# EAGLE design interro-io-board-r2 (EAGLE 5.11)
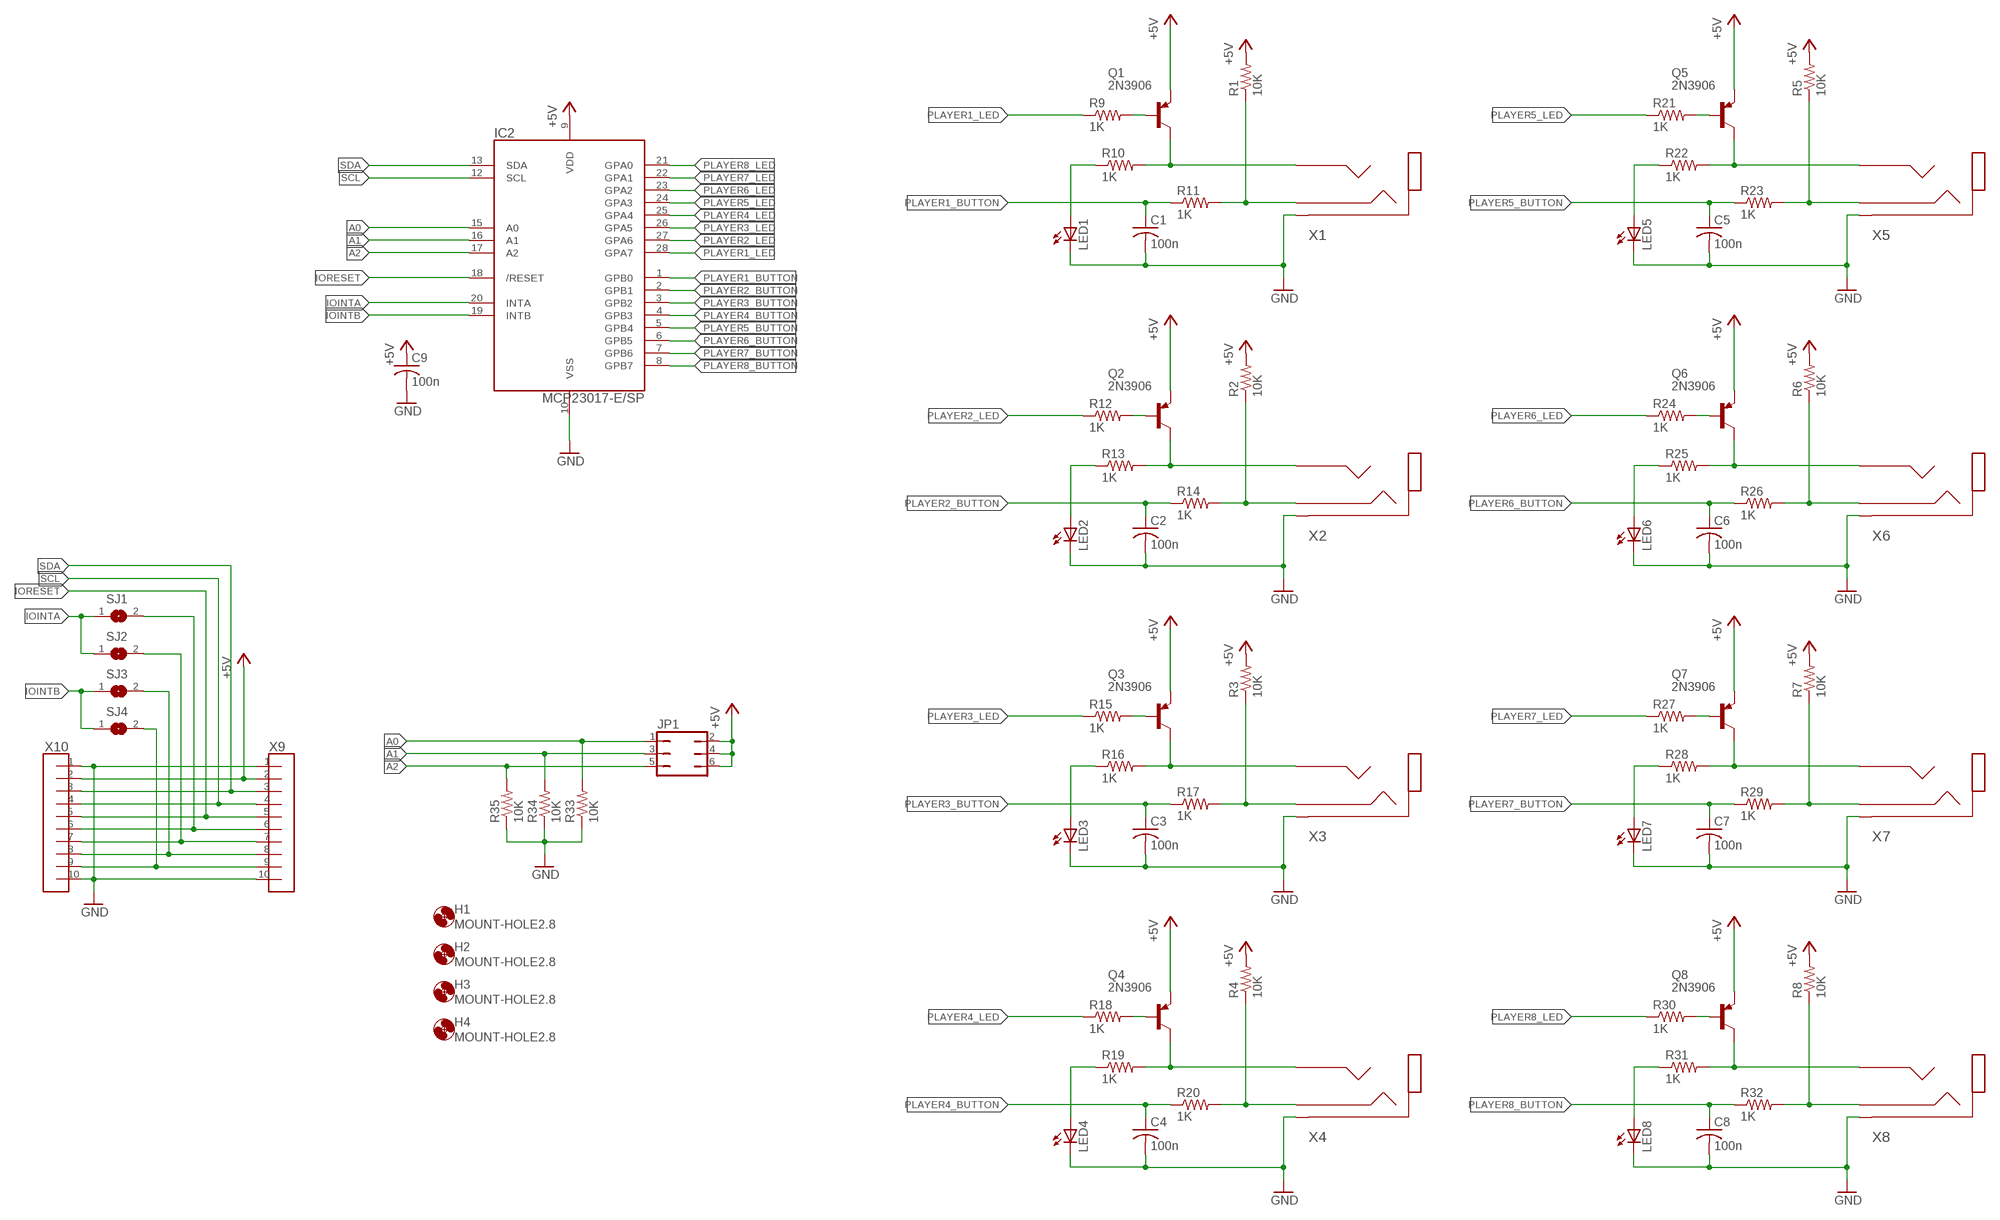
[diagram p0: schematic, sheet 1]

## Parts
C1  100n  C-US050-025X075  [C050-025X075]
C2  100n  C-US050-025X075  [C050-025X075]
C3  100n  C-US050-025X075  [C050-025X075]
C4  100n  C-US050-025X075  [C050-025X075]
C5  100n  C-US050-025X075  [C050-025X075]
C6  100n  C-US050-025X075  [C050-025X075]
C7  100n  C-US050-025X075  [C050-025X075]
C8  100n  C-US050-025X075  [C050-025X075]
C9  100n  C-US050-025X075  [C050-025X075]
H1  MOUNT-HOLE2.8  [2,8]
H2  MOUNT-HOLE2.8  [2,8]
H3  MOUNT-HOLE2.8  [2,8]
H4  MOUNT-HOLE2.8  [2,8]
IC2  MCP23017-E/SP  [DIP-28S]
JP1  JP3Q  [JP3Q]
LED1  LED3MM  [LED3MM]
LED2  LED3MM  [LED3MM]
LED3  LED3MM  [LED3MM]
LED4  LED3MM  [LED3MM]
LED5  LED3MM  [LED3MM]
LED6  LED3MM  [LED3MM]
LED7  LED3MM  [LED3MM]
LED8  LED3MM  [LED3MM]
Q1  2N3906  [TO92]
Q2  2N3906  [TO92]
Q3  2N3906  [TO92]
Q4  2N3906  [TO92]
Q5  2N3906  [TO92]
Q6  2N3906  [TO92]
Q7  2N3906  [TO92]
Q8  2N3906  [TO92]
R1  10K  R-US_0207/7  [0207/7]
R2  10K  R-US_0207/7  [0207/7]
R3  10K  R-US_0207/7  [0207/7]
R4  10K  R-US_0207/7  [0207/7]
R5  10K  R-US_0207/7  [0207/7]
R6  10K  R-US_0207/7  [0207/7]
R7  10K  R-US_0207/7  [0207/7]
R8  10K  R-US_0207/7  [0207/7]
R9  1K  R-US_0207/7  [0207/7]
R10  1K  R-US_0207/7  [0207/7]
R11  1K  R-US_0207/7  [0207/7]
R12  1K  R-US_0207/7  [0207/7]
R13  1K  R-US_0207/7  [0207/7]
R14  1K  R-US_0207/7  [0207/7]
R15  1K  R-US_0207/7  [0207/7]
R16  1K  R-US_0207/7  [0207/7]
R17  1K  R-US_0207/7  [0207/7]
R18  1K  R-US_0207/7  [0207/7]
R19  1K  R-US_0207/7  [0207/7]
R20  1K  R-US_0207/7  [0207/7]
R21  1K  R-US_0207/7  [0207/7]
R22  1K  R-US_0207/7  [0207/7]
R23  1K  R-US_0207/7  [0207/7]
R24  1K  R-US_0207/7  [0207/7]
R25  1K  R-US_0207/7  [0207/7]
R26  1K  R-US_0207/7  [0207/7]
R27  1K  R-US_0207/7  [0207/7]
R28  1K  R-US_0207/7  [0207/7]
R29  1K  R-US_0207/7  [0207/7]
R30  1K  R-US_0207/7  [0207/7]
R31  1K  R-US_0207/7  [0207/7]
R32  1K  R-US_0207/7  [0207/7]
R33  10K  R-US_0207/7  [0207/7]
R34  10K  R-US_0207/7  [0207/7]
R35  10K  R-US_0207/7  [0207/7]
SJ1  SJ  [SJ]
SJ2  SJ  [SJ]
SJ3  SJ  [SJ]
SJ4  SJ  [SJ]
X1  SJ1-3533N  [SJ1-3533N]
X2  SJ1-3533N  [SJ1-3533N]
X3  SJ1-3533N  [SJ1-3533N]
X4  SJ1-3533N  [SJ1-3533N]
X5  SJ1-3533N  [SJ1-3533N]
X6  SJ1-3533N  [SJ1-3533N]
X7  SJ1-3533N  [SJ1-3533N]
X8  SJ1-3533N  [SJ1-3533N]
X9  M10-100MIL  [100MIL-10]
X10  M10-100MIL  [100MIL-10]

## Nets
+5V: C9.1 IC2.9(VDD) JP1.2 JP1.4 JP1.6 Q1.3(E) Q2.3(E) Q3.3(E) Q4.3(E) Q5.3(E) Q6.3(E) Q7.3(E) Q8.3(E) R1.2 R2.2 R3.2 R4.2 R5.2 R6.2 R7.2 R8.2 X9.2 X10.2
A0: IC2.15(A0) JP1.1 R33.2
A1: IC2.16(A1) JP1.3 R34.2
A2: IC2.17(A2) JP1.5 R35.2
GND: C1.2 C2.2 C3.2 C4.2 C5.2 C6.2 C7.2 C8.2 C9.2 IC2.10(VSS) LED1.K(C) LED2.K(C) LED3.K(C) LED4.K(C) LED5.K(C) LED6.K(C) LED7.K(C) LED8.K(C) R33.1 R34.1 R35.1 X1.SHIELD(SLEEVE) X2.SHIELD(SLEEVE) X3.SHIELD(SLEEVE) X4.SHIELD(SLEEVE) X5.SHIELD(SLEEVE) X6.SHIELD(SLEEVE) X7.SHIELD(SLEEVE) X8.SHIELD(SLEEVE) X9.1 X9.10 X10.1 X10.10
IOINTA: IC2.20(INTA) SJ1.1 SJ2.1
IOINTB: IC2.19(INTB) SJ3.1 SJ4.1
IORESET: IC2.18(/RESET) X9.5 X10.5
N$1: SJ2.2 X9.7 X10.7
N$2: SJ3.2 X9.8 X10.8
N$3: SJ4.2 X9.9 X10.9
N$5: SJ1.2 X9.6 X10.6
N$9: R1.1 R11.2 X1.RING
N$10: Q1.1(C) R10.2 X1.TIP
N$12: Q1.2(B) R9.2
N$13: LED1.A R10.1
N$14: R2.1 R14.2 X2.RING
N$15: Q2.1(C) R13.2 X2.TIP
N$16: Q2.2(B) R12.2
N$17: LED2.A R13.1
N$18: R3.1 R17.2 X3.RING
N$19: Q3.1(C) R16.2 X3.TIP
N$20: Q3.2(B) R15.2
N$21: LED3.A R16.1
N$22: R4.1 R20.2 X4.RING
N$23: Q4.1(C) R19.2 X4.TIP
N$24: Q4.2(B) R18.2
N$25: LED4.A R19.1
N$26: R5.1 R23.2 X5.RING
N$27: Q5.1(C) R22.2 X5.TIP
N$28: Q5.2(B) R21.2
N$29: LED5.A R22.1
N$30: R6.1 R26.2 X6.RING
N$31: Q6.1(C) R25.2 X6.TIP
N$32: Q6.2(B) R24.2
N$33: LED6.A R25.1
N$34: R7.1 R29.2 X7.RING
N$35: Q7.1(C) R28.2 X7.TIP
N$36: Q7.2(B) R27.2
N$37: LED7.A R28.1
N$38: R8.1 R32.2 X8.RING
N$39: Q8.1(C) R31.2 X8.TIP
N$40: Q8.2(B) R30.2
N$41: LED8.A R31.1
PLAYER1_BUTTON: C1.1 IC2.1(GPB0) R11.1
PLAYER1_LED: IC2.28(GPA7) R9.1
PLAYER2_BUTTON: C2.1 IC2.2(GPB1) R14.1
PLAYER2_LED: IC2.27(GPA6) R12.1
PLAYER3_BUTTON: C3.1 IC2.3(GPB2) R17.1
PLAYER3_LED: IC2.26(GPA5) R15.1
PLAYER4_BUTTON: C4.1 IC2.4(GPB3) R20.1
PLAYER4_LED: IC2.25(GPA4) R18.1
PLAYER5_BUTTON: C5.1 IC2.5(GPB4) R23.1
PLAYER5_LED: IC2.24(GPA3) R21.1
PLAYER6_BUTTON: C6.1 IC2.6(GPB5) R26.1
PLAYER6_LED: IC2.23(GPA2) R24.1
PLAYER7_BUTTON: C7.1 IC2.7(GPB6) R29.1
PLAYER7_LED: IC2.22(GPA1) R27.1
PLAYER8_BUTTON: C8.1 IC2.8(GPB7) R32.1
PLAYER8_LED: IC2.21(GPA0) R30.1
SCL: IC2.12(SCL) X9.4 X10.4
SDA: IC2.13(SDA) X9.3 X10.3

## Library data of the parts
C1-C9 = rcl:C-US: CAPACITOR, American symbol
H1-H4 = holes:MOUNT-HOLE: MOUNTING HOLE with drill center marker
IC2 = rbg-microchip-ioexpander:MCP23017
JP1 = jumper:JP3Q: JUMPER
LED1-LED8 = led:LED: LED OSRAM: - CHIPLED LG R971, LG N971, LY N971, LG Q971, LY Q971, LO R971, LY R971 LH N974, LH R974 LS Q976, LO Q976, LY Q976 LO Q996 - Hyper CHIPLED LW Q18S LB Q993, LB Q99A, LB R99A - SideLED LS A670, LO A670, LY A670, LG A670, LP A670 LB A673, LV A673, LT A673, LW A673 LH A674 LY A675 LS A676, LA A676, LO A676, LY A676, LW A676 LS A679, LY A679, LG A679 - Hyper Micro SIDELED® LS Y876, LA Y876, LO Y876, LY Y876 LT Y87S - SmartLED LW L88C, LW L88S LB L89C, LB L89S, LG L890 LS L89K, LO L89K, LY L89K LS L896, LA L896, LO L896, LY L896 - TOPLED LS T670, LO T670, LY T670, LG T670, LP T670 LSG T670, LSP T670, LSY T670, LOP T670, LYG T670 LG T671, LOG T671, LSG T671 LB T673, LV T673, LT T673, LW T673 LH T674 LS T676, LA T676, LO T676, LY T676, LB T676, LH T676, LSB T676, LW T676 LB T67C, LV T67C, LT T67C, LS T67K, LO T67K, LY T67K, LW E67C LS E67B, LA E67B, LO E67B, LY E67B, LB E67C, LV E67C, LT E67C LW T67C LS T679, LY T679, LG T679 LS T770, LO T770, LY T770, LG T770, LP T770 LB T773, LV T773, LT T773, LW T773 LH T774 LS E675, LA E675, LY E675, LS T675 LS T776, LA T776, LO T776, LY T776, LB T776 LHGB T686 LT T68C, LB T68C - Hyper Mini TOPLED® LB M676 - Mini TOPLED Santana® LG M470 LS M47K, LO M47K, LY M47K Source: http://www.osram.convergy.de LUXEON: - LUMILED® LXK2-PW12-R00, LXK2-PW12-S00, LXK2-PW14-U00, LXK2-PW14-V00 LXK2-PM12-R00, LXK2-PM12-S00, LXK2-PM14-U00 LXK2-PE12-Q00, LXK2-PE12-R00, LXK2-PE12-S00, LXK2-PE14-T00, LXK2-PE14-U00 LXK2-PB12-K00, LXK2-PB12-L00, LXK2-PB12-M00, LXK2-PB14-N00, LXK2-PB14-P00, LXK2-PB14-Q00 LXK2-PR12-L00, LXK2-PR12-M00, LXK2-PR14-Q00, LXK2-PR14-R00 LXK2-PD12-Q00, LXK2-PD12-R00, LXK2-PD12-S00 LXK2-PH12-R00, LXK2-PH12-S00 LXK2-PL12-P00, LXK2-PL12-Q00, LXK2-PL12-R00 Source: www.luxeon.com KINGBRIGHT: KA-3528ASYC Source: www.kingbright.com
Q1-Q8 = transistor-pnp:2N3906: PNP Transistor
R1-R35 = rcl:R-US_: RESISTOR, American symbol
SJ1-SJ4 = jumper:SJ: SMD solder JUMPER
X1-X8 = rbg-cui-audio:SJ1-3533N
X9 X10 = rbg-generic-headers:M10-100MIL

## Board
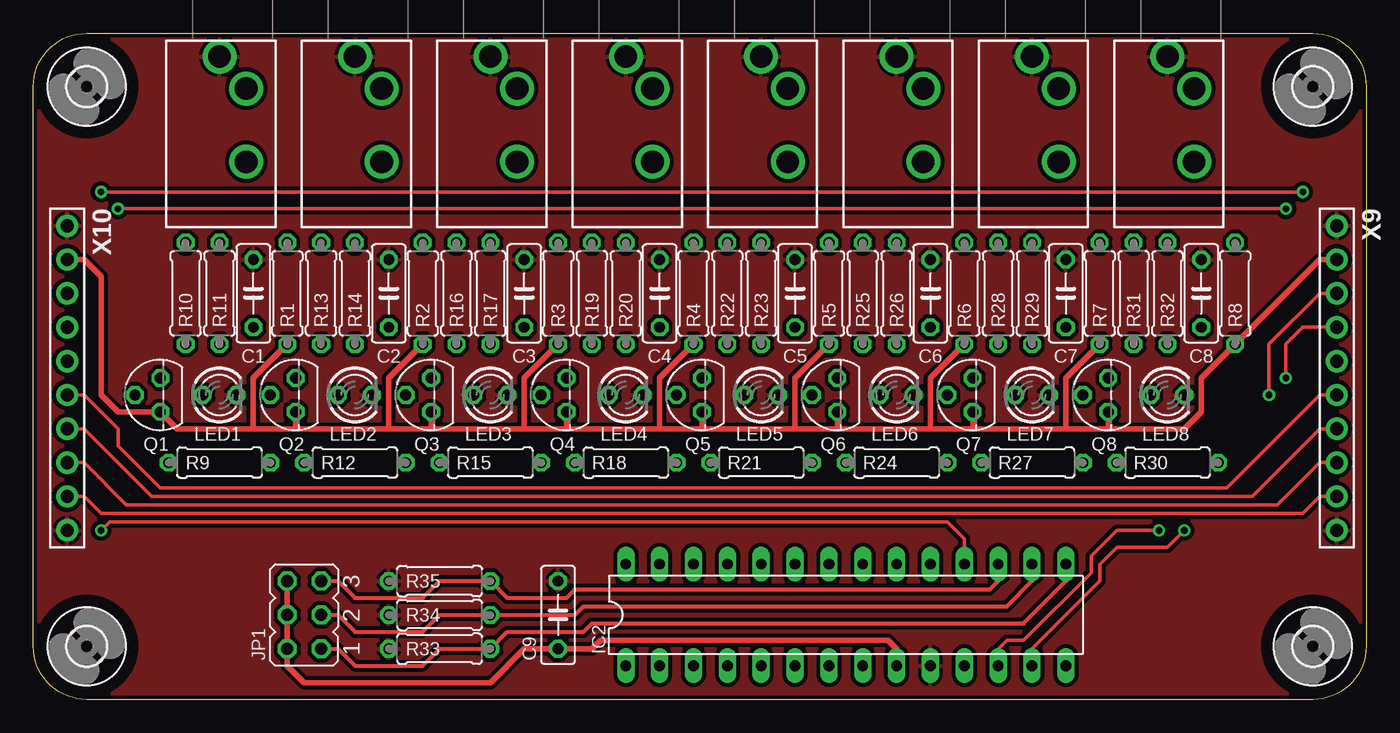
[diagram p1: board, top side]
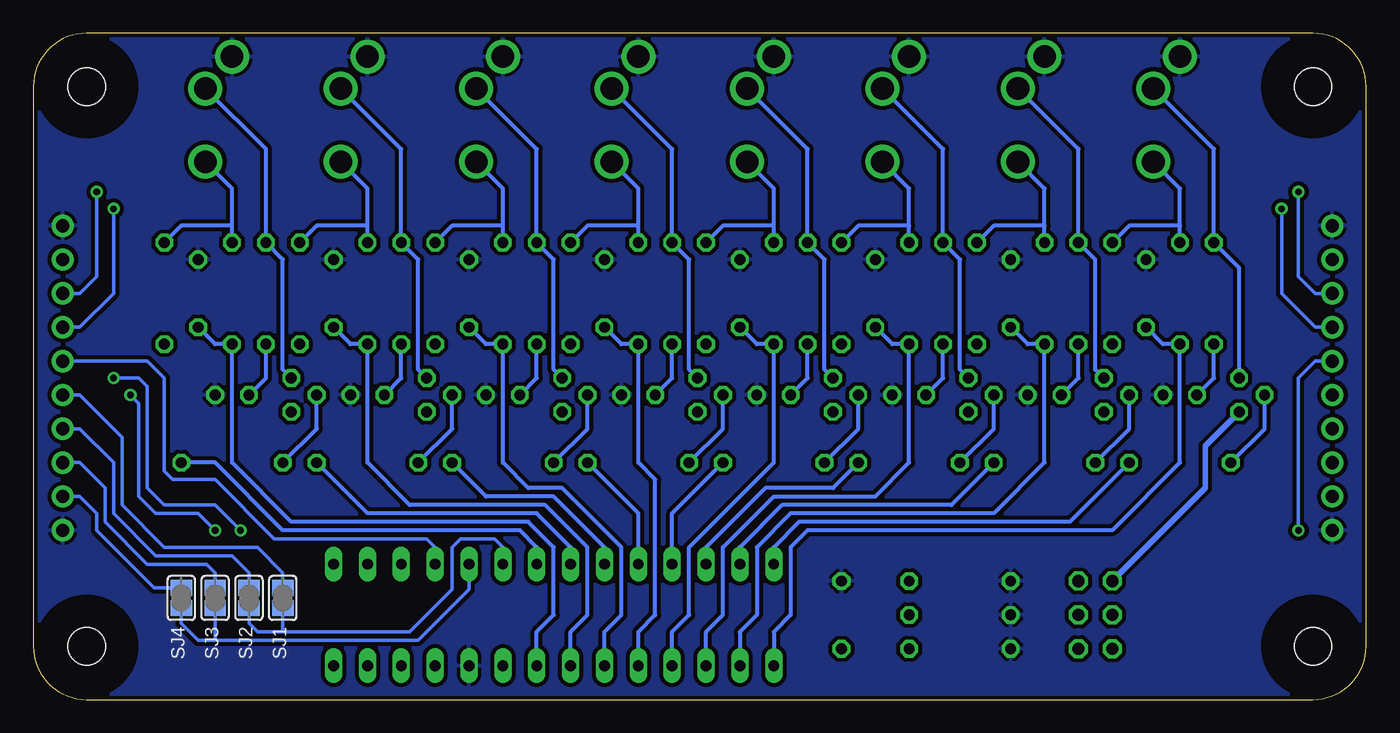
[diagram p2: board, bottom side, seen from below]

Size 100 x 50 mm. Coordinates in mm from the lower left corner, seen from the top.
Outline: 0,46 arc-90 4,50 96,50 arc-90 100,46 100,4 arc-90 96,0 4,0 arc-90 0,4 0,46
Copper layers (1*16): Top 0.035mm / dielectric 1.5mm / Bottom 0.035mm
Design rules "default *": minimum track width 10mil, minimum drill 19mil, track to track 10mil, track to pad 10mil, pad to pad 10mil, via to via 10mil, smd to smd 10mil, copper to edge 10mil, drill to drill 8mil, minimum pad ring 10mil, minimum via ring 8mil, stop-mask expansion 4mil, vias tented up to drill 20mil, thermal gap 10mil

### Footprints (pad centres in the part's own frame; a part is rotated, then mirrored left to right if it is on the bottom)
C050-025X075 = drill 0.813 octagon: 1 -2.54,0; 2 2.54,0
2,8 = hole 2.8: 0,0
DIP-28S = drill 0.813 long: 1 -16.51,-3.81; 2 -13.97,-3.81; 3 -11.43,-3.81; 4 -8.89,-3.81; 5 -6.35,-3.81; 6 -3.81,-3.81; 7 -1.27,-3.81; 8 1.27,-3.81; 9 3.81,-3.81; 10 6.35,-3.81; 11 8.89,-3.81; 12 11.43,-3.81; 13 13.97,-3.81; 14 16.51,-3.81; 15 16.51,3.81; 16 13.97,3.81; 17 11.43,3.81; 18 8.89,3.81; 19 6.35,3.81; 20 3.81,3.81; 21 1.27,3.81; 22 -1.27,3.81; 23 -3.81,3.81; 24 -6.35,3.81; 25 -8.89,3.81; 26 -11.43,3.81; 27 -13.97,3.81; 28 -16.51,3.81
JP3Q = drill 0.914 octagon: 1 -2.54,-1.27; 2 -2.54,1.27; 3 0,-1.27; 4 0,1.27; 5 2.54,-1.27; 6 2.54,1.27
LED3MM = drill 0.813 octagon: A -1.27,0; K 1.27,0
TO92 = drill 0.813 octagon: 1 1.27,0; 2 0,1.905; 3 -1.27,0
0207/7 = drill 0.813 octagon: 1 -3.81,0; 2 3.81,0
SJ = smd 1.168 x 1.6: 1 -0.762,0; 2 0.762,0
SJ1-3533N = drill 1.7 round: RING 7.9,2; SHIELD 0,0; TIP 2.4,2
100MIL-10 = drill 1 pad 1.676 round: 1 -11.43,0; 2 -8.89,0; 3 -6.35,0; 4 -3.81,0; 5 -1.27,0; 6 1.27,0; 7 3.81,0; 8 6.35,0; 9 8.89,0; 10 11.43,0

### Placement (x,y rotation side)
C1  16.51,30.48 90 top
C2  26.67,30.48 90 top
C3  36.83,30.48 90 top
C4  46.99,30.48 90 top
C5  57.15,30.48 90 top
C6  67.31,30.48 90 top
C7  77.47,30.48 90 top
C8  87.63,30.48 90 top
C9  39.37,6.35 90 top
H1  4,4 0 top
H2  4,46 0 top
H3  96,46 0 top
H4  96,4 0 top
IC2  60.96,6.35 0 top
JP1  20.32,6.35 90 top
LED1  13.97,22.86 0 top
LED2  24.13,22.86 0 top
LED3  34.29,22.86 0 top
LED4  44.45,22.86 0 top
LED5  54.61,22.86 0 top
LED6  64.77,22.86 0 top
LED7  74.93,22.86 0 top
LED8  85.09,22.86 0 top
Q1  9.53,22.86 90 top
Q2  19.68,22.86 90 top
Q3  29.84,22.86 90 top
Q4  40.01,22.86 90 top
Q5  50.16,22.86 90 top
Q6  60.33,22.86 90 top
Q7  70.48,22.86 90 top
Q8  80.64,22.86 90 top
R1  19.05,30.48 270 top
R2  29.21,30.48 270 top
R3  39.37,30.48 270 top
R4  49.53,30.48 270 top
R5  59.69,30.48 270 top
R6  69.85,30.48 270 top
R7  80.01,30.48 270 top
R8  90.17,30.48 270 top
R9  13.97,17.78 180 top
R10  11.43,30.48 90 top
R11  13.97,30.48 90 top
R12  24.13,17.78 180 top
R13  21.59,30.48 90 top
R14  24.13,30.48 90 top
R15  34.29,17.78 180 top
R16  31.75,30.48 90 top
R17  34.29,30.48 90 top
R18  44.45,17.78 180 top
R19  41.91,30.48 90 top
R20  44.45,30.48 90 top
R21  54.61,17.78 180 top
R22  52.07,30.48 90 top
R23  54.61,30.48 90 top
R24  64.77,17.78 180 top
R25  62.23,30.48 90 top
R26  64.77,30.48 90 top
R27  74.93,17.78 180 top
R28  72.39,30.48 90 top
R29  74.93,30.48 90 top
R30  85.09,17.78 180 top
R31  82.55,30.48 90 top
R32  85.09,30.48 90 top
R33  30.48,3.81 0 top
R34  30.48,6.35 0 top
R35  30.48,8.89 0 top
SJ1  81.28,7.62 90 bottom
SJ2  83.82,7.62 90 bottom
SJ3  86.36,7.62 90 bottom
SJ4  88.9,7.62 90 bottom
X1  13.97,48.26 270 top
X2  24.13,48.26 270 top
X3  34.29,48.26 270 top
X4  44.45,48.26 270 top
X5  54.61,48.26 270 top
X6  64.77,48.26 270 top
X7  74.93,48.26 270 top
X8  85.09,48.26 270 top
X9  97.79,24.13 270 top
X10  2.54,24.13 270 top

### Tracks (layer width: path | path; a pad name or v marks a point on that pad's centre or on a via)
+5V
  Top 0.406: 19.68,20.32 26.67,20.32 | 26.67,20.32 29.84,20.32 | 29.84,20.32 36.83,20.32 | 36.83,20.32 40.01,20.32 | 40.01,20.32 46.99,20.32 | 46.99,20.32 50.16,20.32 | 50.16,20.32 57.15,20.32 | 57.15,20.32 60.33,20.32 | 60.33,20.32 67.31,20.32 | 67.31,20.32 70.48,20.32 | 70.48,20.32 77.47,20.32 | 70.48,20.32 Q7.3 | 60.33,20.32 Q6.3 | 50.16,20.32 Q5.3 | 40.01,20.32 Q4.3 | 29.84,20.32 Q3.3 | 19.68,20.32 Q2.3 | 16.51,20.32 10.79,20.32 Q1.3 6.35,21.59 5.08,22.86 5.08,31.75 3.81,33.02 X10.2 | 16.51,20.32 19.68,20.32 | R1.2 16.51,24.13 16.51,20.32 | R2.2 26.67,24.13 26.67,20.32 | R3.2 36.83,24.13 36.83,20.32 | R4.2 46.99,24.13 46.99,20.32 | R5.2 57.15,24.13 57.15,20.32 | R6.2 67.31,24.13 67.31,20.32 | R7.2 77.47,24.13 77.47,20.32 | 80.64,20.32 86.36,20.32 87.63,21.59 87.63,24.13 R8.2 96.52,33.02 X9.2 | 80.64,20.32 Q8.3 | 77.47,20.32 80.64,20.32 | JP1.6 JP1.4 JP1.2 19.05,2.54 20.32,1.27 34.29,1.27 36.83,3.81 C9.1 41.91,3.81 42.55,4.45 64.14,4.45 64.77,3.81 IC2.9
  Bottom 0.406: JP1.6 12.06,15.88 12.06,19.05 Q1.3
A0
  Top 0.305: IC2.15 77.47,8.89 74.3,5.71 41.91,5.71 41.27,5.08 35.56,5.08 R33.2 30.48,3.81 29.21,2.54 24.13,2.54 22.86,3.81 JP1.1
A1
  Top 0.305: IC2.16 74.93,8.89 73.03,6.99 41.27,6.99 40.64,6.35 R34.2 30.48,6.35 29.21,5.08 24.13,5.08 22.86,6.35 JP1.3
A2
  Top 0.305: IC2.17 72.39,8.89 71.75,8.26 40.64,8.26 40.01,7.62 35.56,7.62 R35.2 30.48,8.89 29.21,7.62 24.13,7.62 22.86,8.89 JP1.5
GND
  pour Bottom (isolate 0.305): -1.27,50.8 100.33,50.8 100.33,0 100.33,-1.27 -1.27,-1.27
  pour Top (isolate 0.305): -1.27,50.8 100.33,50.8 100.33,0 100.33,-1.27 -1.27,-1.27
IOINTA
  Bottom 0.254: IC2.20 64.77,11.43 65.41,12.06 67.94,12.06 68.58,11.43 68.58,8.26 71.75,5.08 81.28,5.08 | 81.28,5.08 83.19,5.08 83.82,5.71 SJ2.1 | 81.28,5.08 SJ1.1
IOINTB
  Bottom 0.254: SJ4.1 88.9,5.71 87.63,4.45 86.36,4.45 | 86.36,4.45 71.12,4.45 67.31,8.26 IC2.19 | 86.36,4.45 SJ3.1
IORESET  (via drill 0.5)
  Top 0.254: v5.08,12.7 5.71,13.34 68.58,13.34 69.85,12.06 IC2.18
  Bottom 0.254: X10.5 3.81,25.4 5.08,24.13 v5.08,12.7 | X9.5 91.44,25.4 90.17,24.13 90.17,17.14 89.53,16.51 86.36,16.51 81.92,12.06 70.48,12.06 69.85,11.43 IC2.18
N$1
  Top 0.254: X10.7 3.81,20.32 8.89,15.24 91.44,15.24 96.52,20.32 X9.7
  Bottom 0.254: SJ2.2 83.82,9.53 85.09,10.79 90.81,10.79 93.98,13.97 93.98,17.78 96.52,20.32 X9.7
N$2
  Top 0.254: X10.8 3.81,17.78 6.99,14.61 93.34,14.61 96.52,17.78 X9.8
  Bottom 0.254: SJ3.2 86.36,9.53 87,10.16 91.44,10.16 94.61,13.34 94.61,15.88 96.52,17.78 X9.8
N$3
  Top 0.254: X9.9 96.52,15.24 95.25,13.97 5.08,13.97 3.81,15.24 X10.9
  Bottom 0.254: SJ4.2 90.93,8.38 95.25,12.7 95.25,13.97 96.52,15.24 X9.9
N$5
  Top 0.254: X10.6 3.81,22.86 6.35,20.32 6.35,19.05 9.53,15.88 89.53,15.88 96.52,22.86 X9.6
  Bottom 0.254: SJ1.2 81.28,9.53 83.19,11.43 90.17,11.43 93.34,14.61 93.34,19.68 96.52,22.86 X9.6
N$9
  Bottom 0.305: R11.2 13.97,35.56 | 13.97,35.56 13.97,38.36 X1.RING | R1.1 17.78,35.56 13.97,35.56
N$10
  Bottom 0.305: X1.TIP 11.43,41.32 R10.2 9.53,32.38 Q1.1
N$12
  Bottom 0.305: Q1.2 7.62,20.32 R9.2
N$13
  Bottom 0.305: R10.1 11.43,24.13 LED1.A
N$14
  Bottom 0.305: R14.2 24.13,35.56 | 24.13,35.56 24.13,38.36 X2.RING | R2.1 27.94,35.56 24.13,35.56
N$15
  Bottom 0.305: X2.TIP 21.59,41.32 R13.2 20.32,33.02 20.32,24.77 Q2.1
N$16
  Bottom 0.305: Q2.2 17.78,20.32 R12.2
N$17
  Bottom 0.305: R13.1 21.59,24.13 LED2.A
N$18
  Bottom 0.305: R17.2 34.29,35.56 | 34.29,35.56 34.29,38.36 X3.RING | R3.1 38.1,35.56 34.29,35.56
N$19
  Bottom 0.305: X3.TIP 31.75,41.32 R16.2 30.48,33.02 30.48,24.77 Q3.1
N$20
  Bottom 0.305: Q3.2 27.94,20.32 R15.2
N$21
  Bottom 0.305: R16.1 31.75,24.13 LED3.A
N$22
  Bottom 0.305: R20.2 44.45,35.56 | 44.45,35.56 44.45,38.36 X4.RING | R4.1 48.26,35.56 44.45,35.56
N$23
  Bottom 0.305: X4.TIP 41.91,41.32 R19.2 40.64,33.02 40.64,24.77 Q4.1
N$24
  Bottom 0.305: Q4.2 38.1,20.32 R18.2
N$25
  Bottom 0.305: R19.1 41.91,24.13 LED4.A
N$26
  Bottom 0.305: R23.2 54.61,35.56 | 54.61,35.56 54.61,38.36 X5.RING | R5.1 58.42,35.56 54.61,35.56
N$27
  Bottom 0.305: X5.TIP 52.07,41.32 R22.2 50.8,33.02 50.8,24.77 Q5.1
N$28
  Bottom 0.305: Q5.2 48.26,20.32 R21.2
N$29
  Bottom 0.305: R22.1 52.07,24.13 LED5.A
N$30
  Bottom 0.305: R26.2 64.77,35.56 | 64.77,35.56 64.77,38.36 X6.RING | R6.1 68.58,35.56 64.77,35.56
N$31
  Bottom 0.305: X6.TIP 62.23,41.32 R25.2 60.96,33.02 60.96,24.77 Q6.1
N$32
  Bottom 0.305: Q6.2 58.42,20.32 R24.2
N$33
  Bottom 0.305: R25.1 62.23,24.13 LED6.A
N$34
  Bottom 0.305: R29.2 74.93,35.56 | 74.93,35.56 74.93,38.36 X7.RING | R7.1 78.74,35.56 74.93,35.56
N$35
  Bottom 0.305: X7.TIP 72.39,41.32 R28.2 71.12,33.02 71.12,24.77 Q7.1
N$36
  Bottom 0.305: Q7.2 68.58,20.32 R27.2
N$37
  Bottom 0.305: R28.1 72.39,24.13 LED7.A
N$38
  Bottom 0.305: R32.2 85.09,35.56 | 85.09,35.56 85.09,38.36 X8.RING | R8.1 88.9,35.56 85.09,35.56
N$39
  Bottom 0.305: X8.TIP 82.55,41.32 R31.2 81.28,33.02 81.28,24.77 Q8.1
N$40
  Bottom 0.305: Q8.2 78.74,20.32 R30.2
N$41
  Bottom 0.305: R31.1 82.55,24.13 LED8.A
PLAYER1_BUTTON
  Bottom 0.305: C1.1 15.24,26.67 R11.1 13.97,17.78 19.05,12.7 41.91,12.7 43.18,11.43 43.18,6.35 44.45,5.08 IC2.1
PLAYER1_LED
  Bottom 0.305: IC2.28 44.45,11.43 42.55,13.34 22.23,13.34 R9.1
PLAYER2_BUTTON
  Bottom 0.305: C2.1 25.4,26.67 R14.1 24.13,17.78 27.94,13.97 43.18,13.97 45.72,11.43 45.72,6.35 46.99,5.08 IC2.2
PLAYER2_LED
  Bottom 0.305: IC2.27 46.99,11.43 43.81,14.61 31.11,14.61 R12.1
PLAYER3_BUTTON
  Bottom 0.305: C3.1 35.56,26.67 R17.1 34.29,17.78 36.83,15.24 44.45,15.24 48.26,11.43 48.26,6.35 49.53,5.08 IC2.3
PLAYER3_LED
  Bottom 0.305: IC2.26 49.53,11.43 45.09,15.88 40.01,15.88 R15.1
PLAYER4_BUTTON
  Bottom 0.305: C4.1 45.72,26.67 R20.1 44.45,17.78 50.8,11.43 50.8,6.35 52.07,5.08 IC2.4
PLAYER4_LED
  Bottom 0.305: IC2.25 52.07,13.97 R18.1
PLAYER5_BUTTON
  Bottom 0.305: C5.1 55.88,26.67 R23.1 54.61,17.78 53.34,16.51 53.34,6.35 54.61,5.08 IC2.5
PLAYER5_LED
  Bottom 0.305: IC2.24 54.61,13.97 R21.1
PLAYER6_BUTTON
  Bottom 0.305: C6.1 66.04,26.67 R26.1 64.77,17.78 62.87,15.88 60.33,15.88 55.88,11.43 55.88,6.35 57.15,5.08 IC2.6
PLAYER6_LED
  Bottom 0.305: IC2.23 57.15,11.43 60.96,15.24 66.04,15.24 R24.1
PLAYER7_BUTTON
  Bottom 0.305: C7.1 76.2,26.67 R29.1 74.93,17.78 71.75,14.61 61.59,14.61 58.42,11.43 58.42,6.35 59.69,5.08 IC2.7
PLAYER7_LED
  Bottom 0.305: IC2.22 59.69,11.43 62.23,13.97 74.93,13.97 R27.1
PLAYER8_BUTTON
  Bottom 0.305: C8.1 86.36,26.67 R32.1 85.09,17.78 80.64,13.34 62.87,13.34 60.96,11.43 60.96,6.35 62.23,5.08 IC2.8
PLAYER8_LED
  Bottom 0.305: IC2.21 62.23,11.43 63.5,12.7 81.28,12.7 86.36,17.78 R30.1
SCL  (via drill 0.5)
  Top 0.254: v6.35,36.83 v93.98,36.83 | IC2.12 72.39,3.81 73.03,4.45 74.3,4.45 79.38,9.53 79.38,10.79 81.28,12.7 v84.45,12.7 | v93.98,24.13 93.98,26.67 95.25,27.94 X9.4
  Bottom 0.254: X10.4 3.81,27.94 6.35,30.48 v6.35,36.83 | v93.98,36.83 93.98,30.48 96.52,27.94 X9.4 | v84.45,12.7 86.36,14.61 90.17,14.61 91.44,15.88 91.44,23.5 92.08,24.13 v93.98,24.13
SDA  (via drill 0.5)
  Top 0.254: v5.08,38.1 v95.25,38.1 | IC2.13 74.93,3.81 80.01,8.89 80.01,10.16 81.28,11.43 85.09,11.43 v86.36,12.7 | v92.71,22.86 92.71,26.67 96.52,30.48 X9.3
  Bottom 0.254: X9.3 96.52,30.48 95.25,31.75 v95.25,38.1 | v5.08,38.1 5.08,31.75 3.81,30.48 X10.3 | v86.36,12.7 87.63,13.97 90.81,13.97 92.08,15.24 92.08,22.23 v92.71,22.86